# EasyEDA Pro project pcb1.epro

# Schematic Schematic1
Board Name: Board1; Create Date: 2024-10-02
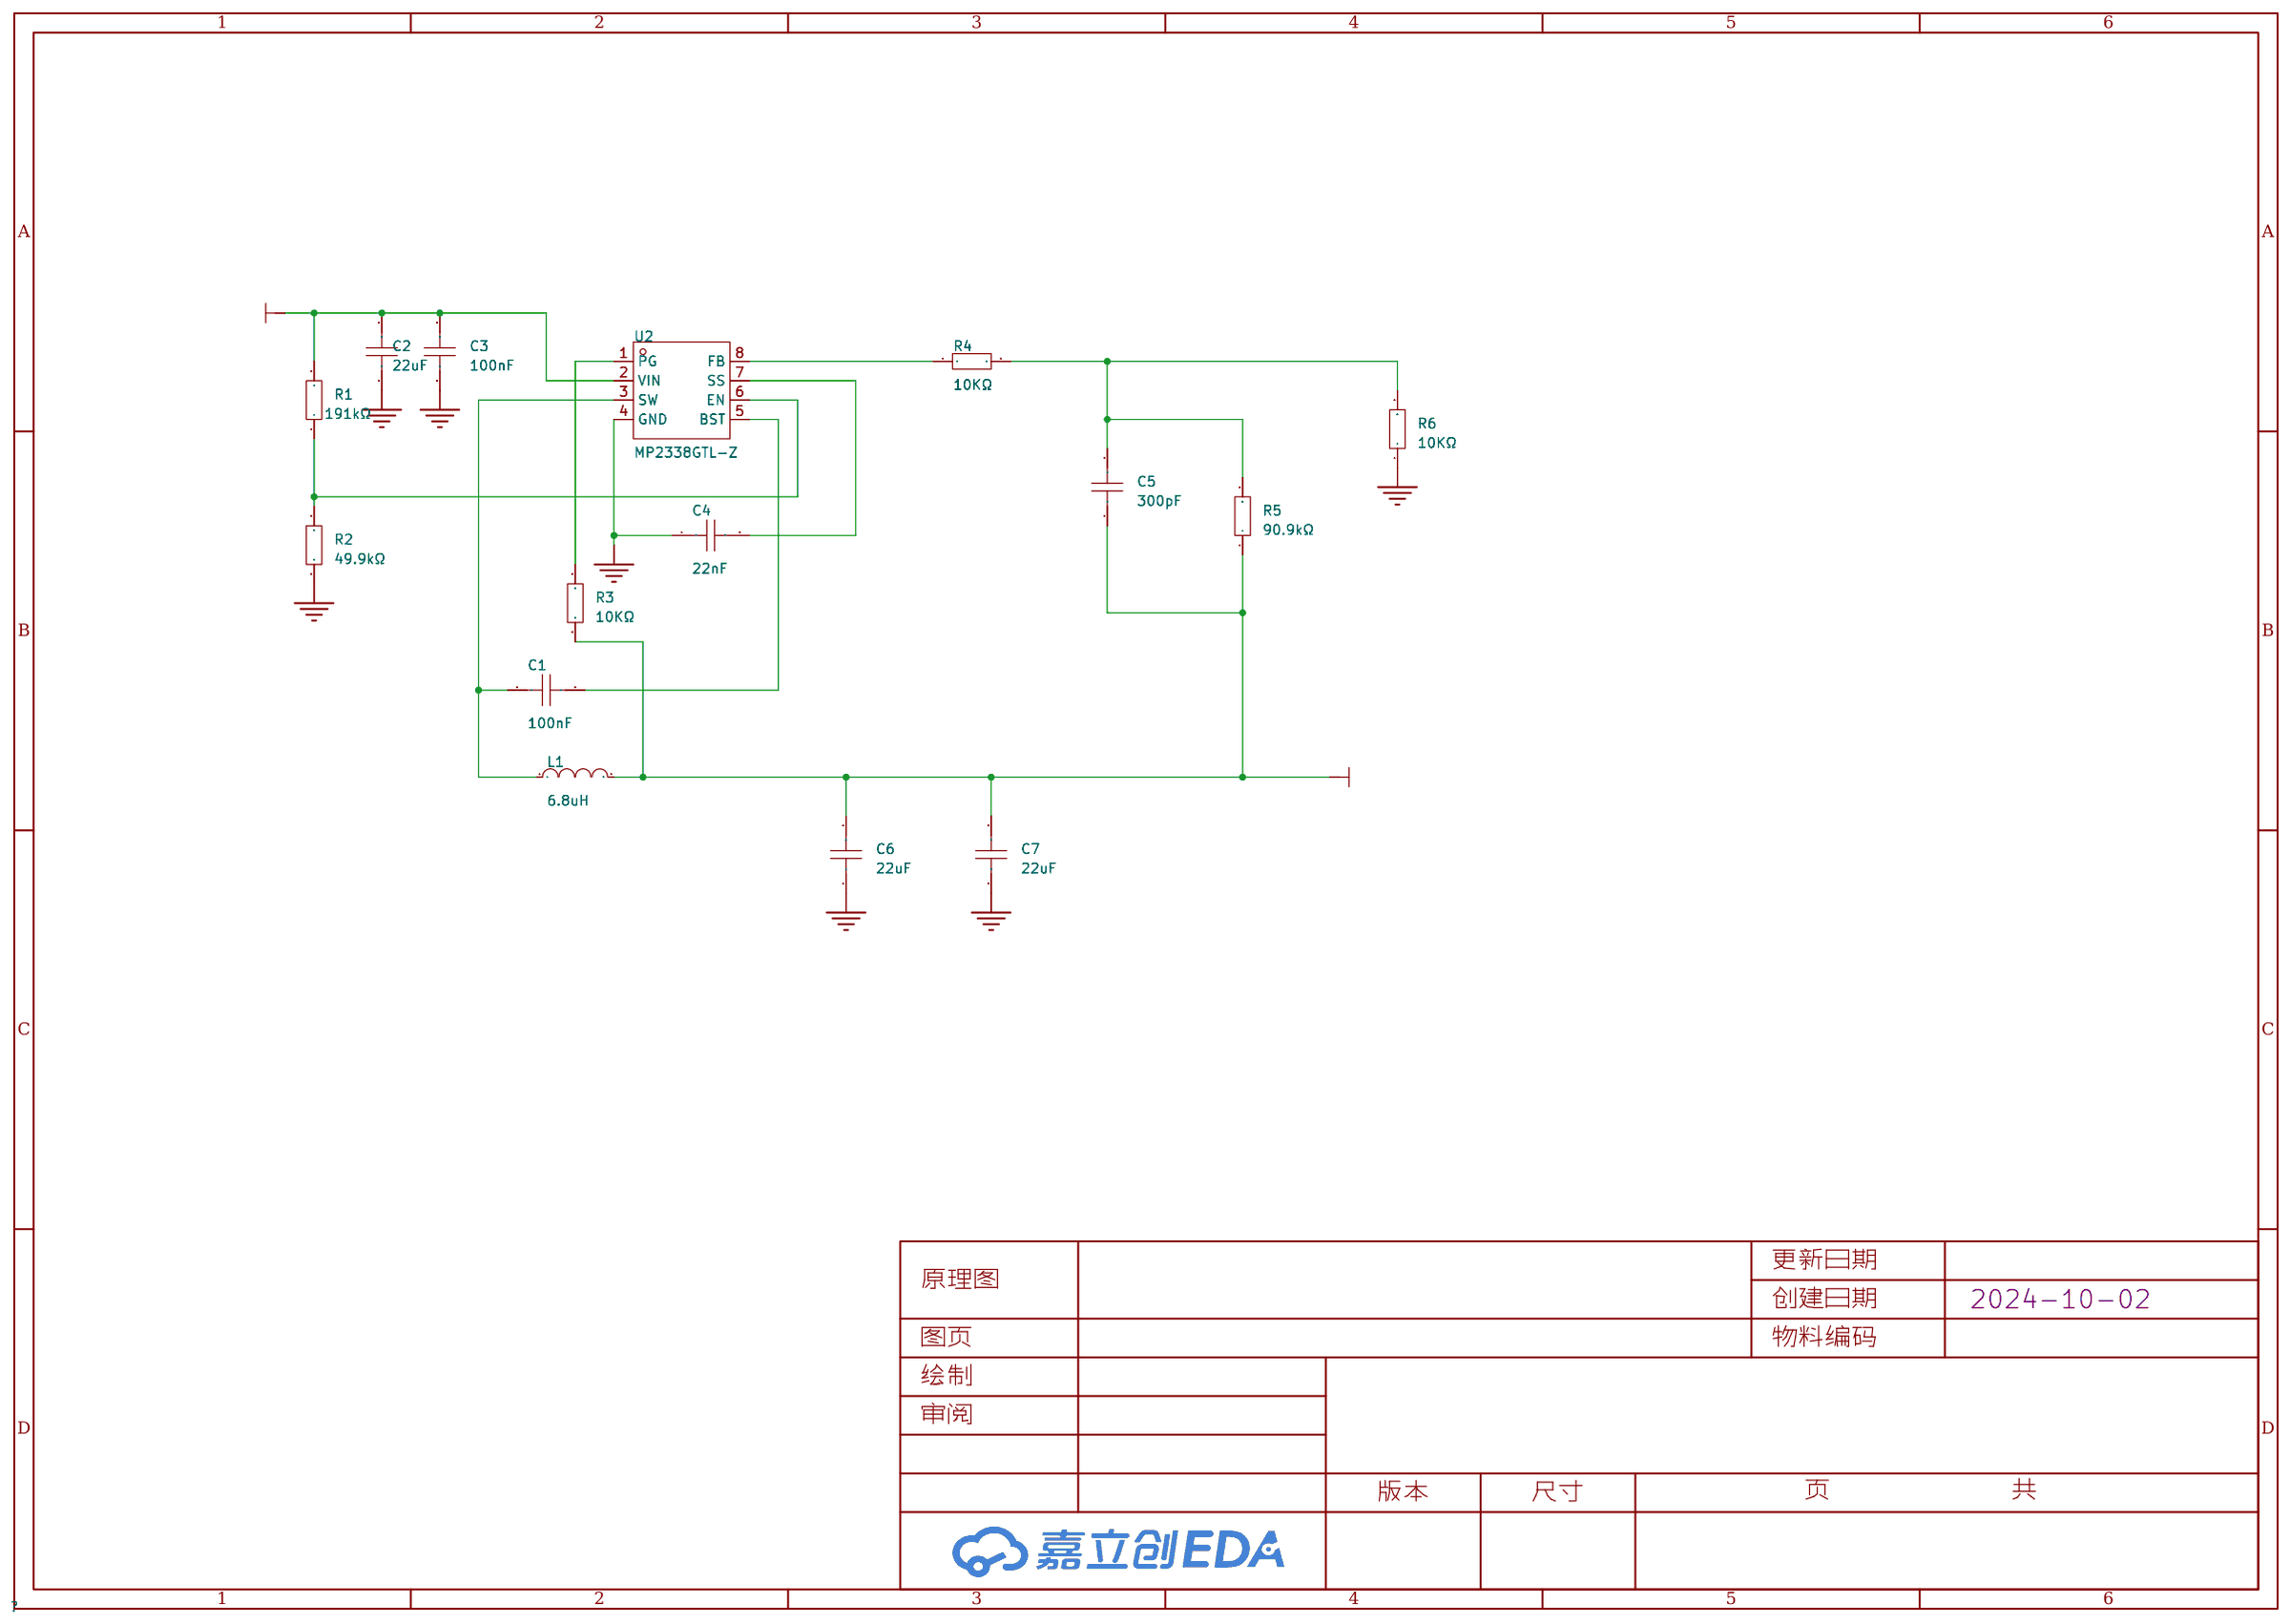
[diagram p0: schematic sheet]

## Parts
C1  100nF  [C0603]
C2  22uF  [C0603]
C3  100nF  [C0603]
C4  22nF  [C0603]
C5  300pF  [C0603]
C6  22uF  [C0603]
C7  22uF  [C0603]
L1  6.8uH  [L0603]
R1  191kΩ  [R0603]
R2  49.9kΩ  [R0603]
R3  10KΩ  [R0603]
R4  10KΩ  [R0603]
R5  90.9kΩ  [R0603]
R6  10KΩ  [R0603]
U2  MP2338GTL-Z  [SOT-583-8_L2.1-W1.2-P0.50-LS1.6-BR]

## Library data of the parts
C1-C7 = CAP_0603: Supplier Footprint: 0603
L1 = L_0603
R1-R6 = Res_0603: Supplier Footprint: 0603
U2 = MP2338GTL-Z_C7210174: Supplier Part: C7210174; Manufacturer: MPS(芯源); Supplier Footprint: SOT-583; JLCPCB Part Class: 扩展库; Datasheet: https://atta.szlcsc.com/upload/public/pdf/source/20240423/047B0C26FE0EA84694A976250651CD0F.pdf; Supplier: LCSC

## Nets
GND: C2.1 C3.1 C4.1 C6.1 C7.1 R2.1 R6.1 U2.4(GND)
VIN: C2.2 C3.2 R1.2 U2.2(VIN)
VOUT: C5.1 C6.2 C7.2 L1.2 R3.1 R5.1
$1N1725: R1.1 R2.2 U2.6(EN)
$1N1816: R3.2 U2.1(PG)
$1N1881: C1.1 L1.1 U2.3(SW)
$1N2044: C1.2 U2.5(BST)
$1N2233: C4.2 U2.7(SS)
$1N2242: R4.1 U2.8(FB)
$1N2342: C5.2 R4.2 R5.2 R6.2

# Board PCB2
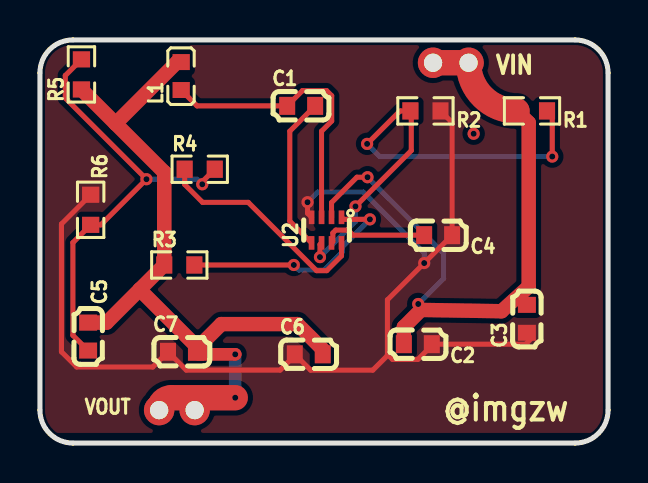
[diagram p1: board, top side]
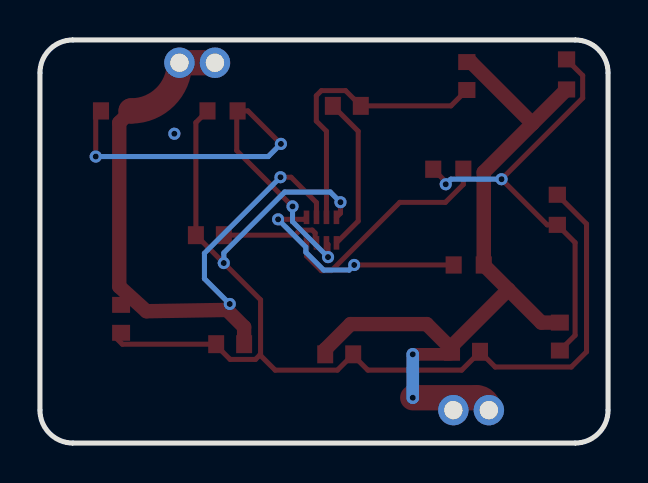
[diagram p2: board, bottom side, seen from below]

Outline 28.45 x 20.19 mm; copper layers: Top Layer, Bottom Layer. Coordinates in mm from the lower left corner of the outline.
Outline path: 0,18.54 0,1.65 arc(0.48,0.48) 1.65,0 26.8,0 arc(27.96,0.48) 28.45,1.65 28.45,18.54 arc(27.96,19.71) 26.8,20.19 1.65,20.19 arc(0.48,19.71) 0,18.54
Stack: Top Layer 0.035mm / Dielectric1 1.51mm FR4 er 4.5 / Bottom Layer 0.035mm

## Design rules (mm)
template: 自定义配置
spacing copperThickness1oz (default): track to track 0.102, other pairs 0.152 to 0.3
spacing copperThickness2oz: track to track 0.203, other pairs 0.152 to 0.3
track width copperThickness1oz (default): min 0.127, default 0.254, max 2.54
track width copperThickness2oz: min 0.203, default 0.254, max 2.54
track width thick: min 0.203, default 1.27, max 2.54
differential pair differentialPair (default): width min 0.127, default 0.254, max 2.54; gap min 0.152, default 0.152
via viaSize (default): diameter min 0.5, default 0.61, max 10; hole min 0.3, default 0.305, max 6.299
net VIN uses thick
net VOUT uses thick

## Placement (name value [footprint] x y rotation side)
C1  100nF  [C0603]  13.08 16.89 0 top
C2  22uF  [C0603]  18.92 4.95 180 top
C3  100nF  [C0603]  24.38 6.22 90 top
C4  22nF  [C0603]  19.94 10.41 180 top
C5  300pF  [C0603]  2.41 5.33 270 top
C6  22uF  [C0603]  13.46 4.44 0 top
C7  22uF  [C0603]  7.11 4.57 0 top
L1  6.8uH  [L0603]  7.07 18.38 90 top
NOREF  -  [Pad_e67]  21.46 19.05 0 top
NOREF#2  -  [Pad_e62]  7.75 1.65 0 top
NOREF#3  -  [Pad_e155]  19.69 19.05 0 top
NOREF#4  -  [Pad_e151]  5.97 1.65 0 top
R1  191kΩ  [R0603]  24.64 16.64 180 top
R2  49.9kΩ  [R0603]  19.3 16.64 180 top
R3  10KΩ  [R0603]  6.98 8.92 0 top
R4  10KΩ  [R0603]  8 13.72 0 top
R5  90.9kΩ  [R0603]  2.08 18.47 90 top
R6  10KΩ  [R0603]  2.54 11.68 270 top
U2  MP2338GTL-Z  [SOT-583-8_L2.1-W1.2-P0.50-LS1.6-BR]  14.35 10.67 90 top

## Footprints (pads in the part's own frame, mm; a bottom-side part is the same pattern mirrored in y, then rotated)
C0603
  rect 0.8x0.9 smd: 1(-0.7,0) 2(0.7,0)
L0603
  rect 0.8x0.864 smd: 1(-0.7,0) 2(0.7,0)
Pad_e62
  round 1.524 hole 0.914: 1(0,0)
Pad_e67
  round 1.524 hole 0.914: 1(0,0)
Pad_e151
  round 1.524 hole 0.914: 1(0,0)
Pad_e155
  round 1.524 hole 0.914: 1(0,0)
R0603
  rect 0.806x0.864 smd: 1(-0.753,0) 2(0.753,0)
SOT-583-8_L2.1-W1.2-P0.50-LS1.6-BR
  rect 0.68x0.28 smd: 1(0.64,-0.75) 2(0.64,-0.25) 3(0.64,0.25) 4(0.64,0.75) 5(-0.64,0.75) 6(-0.64,0.25) 7(-0.64,-0.25) 8(-0.64,-0.75)

## Nets
As in the schematic, except:
VIN: C2.2 C3.2 NOREF.1 NOREF#3.1 R1.2 U2.2
VOUT: C5.1 C6.2 C7.2 L1.2 NOREF#2.1 NOREF#4.1 R3.1 R5.1

## Via types
v1: diameter 0.61, hole 0.305, Top Layer to Bottom Layer, 15 vias

## Routing (per net, layer and track width the routed paths; a pad name or vN(x,y) marks a point on that pad's centre or on a via; arc(x,y) is an arc through that point)
GND: length 57.1
  Top Layer w0.252: v1(13.4,12.06) 13.4,11.51 U2.4
  Top Layer w0.254: R6.1 1.08,10.98 1.08,4.57 1.84,3.81 5.65,3.81 C7.1 7.33,3.66 12.03,3.66 12.79,4.42 ; 17.43,4.42 16.67,3.65 13.55,3.65 12.79,4.42 ; 17.43,4.42 17.65,4.19 18.92,4.19 19.69,4.95 ; 17.43,4.42 17.4,4.44 17.4,7.18 v1(19.24,9.02) C4.1 20.64,16.06 R2.1 ; 12.79,4.42 C6.1 ; 19.69,4.95 C2.1 ; 19.69,4.95 24.32,4.95 24.64,5.27
  Bottom Layer w0.252: v1(19.24,9.02) 19.24,9.52 16.19,12.57 13.91,12.57 v1(13.4,12.06)
VIN: length 34.4
  Top Layer w0.252: 18.94,6.67 v1(18.94,6.97) ; U2.2 14.6,12.05 15.87,13.32 v1(16.4,13.32)
  Top Layer w0.72: R1.2 24.48,16.05 24.48,7.84 23.11,6.6 19.08,6.67 18.22,5.81 C2.2
  Top Layer w1.27: R1.2 23.88,16.64 arc(22.17,17.34) NOREF.1 NOREF#3.1
  Bottom Layer w0.252: v1(16.4,13.32) 20.21,9.51 20.21,8.24 v1(18.94,6.97)
(no net):
  vias: v1(21.72,15.49)
VOUT: length 40.4
  Top Layer w0.254: 7.94,4.44 7.81,4.57
  Top Layer w0.635: v1(9.78,4.44) 7.94,4.44
  Top Layer w0.72: 3.79,16 6.87,19.08 L1.2 ; 7.81,4.57 7.87,4.63 7.81,4.69 ; 7.81,4.69 7.81,4.87 4.99,7.69 ; 7.81,4.69 9.08,5.96 12.89,5.96 14.16,4.69 C6.2 ; C5.1 3.34,6.03 4.99,7.69 ; 4.99,7.69 R3.1
  Top Layer w0.726: R3.1 6.22,13.56 R5.1
  Top Layer w1.27: v1(9.78,2.27) 6.59,2.27 arc(6.15,2.09) NOREF#4.1
  Bottom Layer w0.635: v1(9.78,4.44) v1(9.78,2.27)
$1N1725: length 24.8
  Top Layer w0.252: U2.6 14.02,9.95 v1(14.02,9.31) ; v1(15.8,11.85) 18.59,14.65 18.59,16.68
  Top Layer w0.254: 18.59,16.68 R2.2 18.03,16.64 v1(16.38,14.99) ; R1.1 25.65,16.37 v1(25.65,14.35)
  Bottom Layer w0.252: v1(15.8,11.85) 15.8,11.09 v1(14.02,9.31)
  Bottom Layer w0.254: v1(25.65,14.35) 17.02,14.35 v1(16.38,14.99)
$1N1816: length 11.6
  Top Layer w0.252: v1(16.52,11.21) 15.2,11.21 U2.1 ; R3.2 v1(12.71,8.92)
  Bottom Layer w0.252: v1(16.52,11.21) 15.13,9.82 15.13,9.56 14.24,8.67 12.97,8.67 v1(12.71,8.92)
$1N1881: length 14.6
  Top Layer w0.252: U2.3 14.1,15.62 14.61,16.13 14.61,17.4 14.35,17.65 13.14,17.65 C1.1
  Top Layer w0.254: L1.1 7.87,16.89 C1.1
$1N2044: length 7.8
  Top Layer w0.252: C1.2 12.51,15.62 12.51,11.12 U2.5
$1N2233: length 5.3
  Top Layer w0.252: C4.2 15.68,10.41 15.43,10.67 14.81,10.67 14.67,10.52 14.67,10.09 U2.7
$1N2242: length 11.4
  Top Layer w0.252: R4.1 7.25,12.95 8.15,12.06 10.43,12.06 13.85,8.64 14.36,8.64 15.1,9.38 U2.8
$1N2342: length 22.7
  Top Layer w0.254: R5.2 1.27,18.41 1.27,17.28 v1(5.33,13.22) 3.05,10.93 R6.2 1.65,10.04 1.65,5.4 C5.2 ; v1(8.13,12.96) 8.13,13.09 R4.2
  Bottom Layer w0.254: v1(8.13,12.96) 7.87,13.22 v1(5.33,13.22)

## Copper pours and planes (outline as drawn; the poured copper is in the pictures)
GND on Top Layer: -0.76,20.45 28.57,20.45 28.57,0.51 -0.76,0.51

## Text on the board
Top Silkscreen Layer: VOUT | VIN | @imgzw
